# EAGLE design weightmeter (EAGLE 7.2.0)
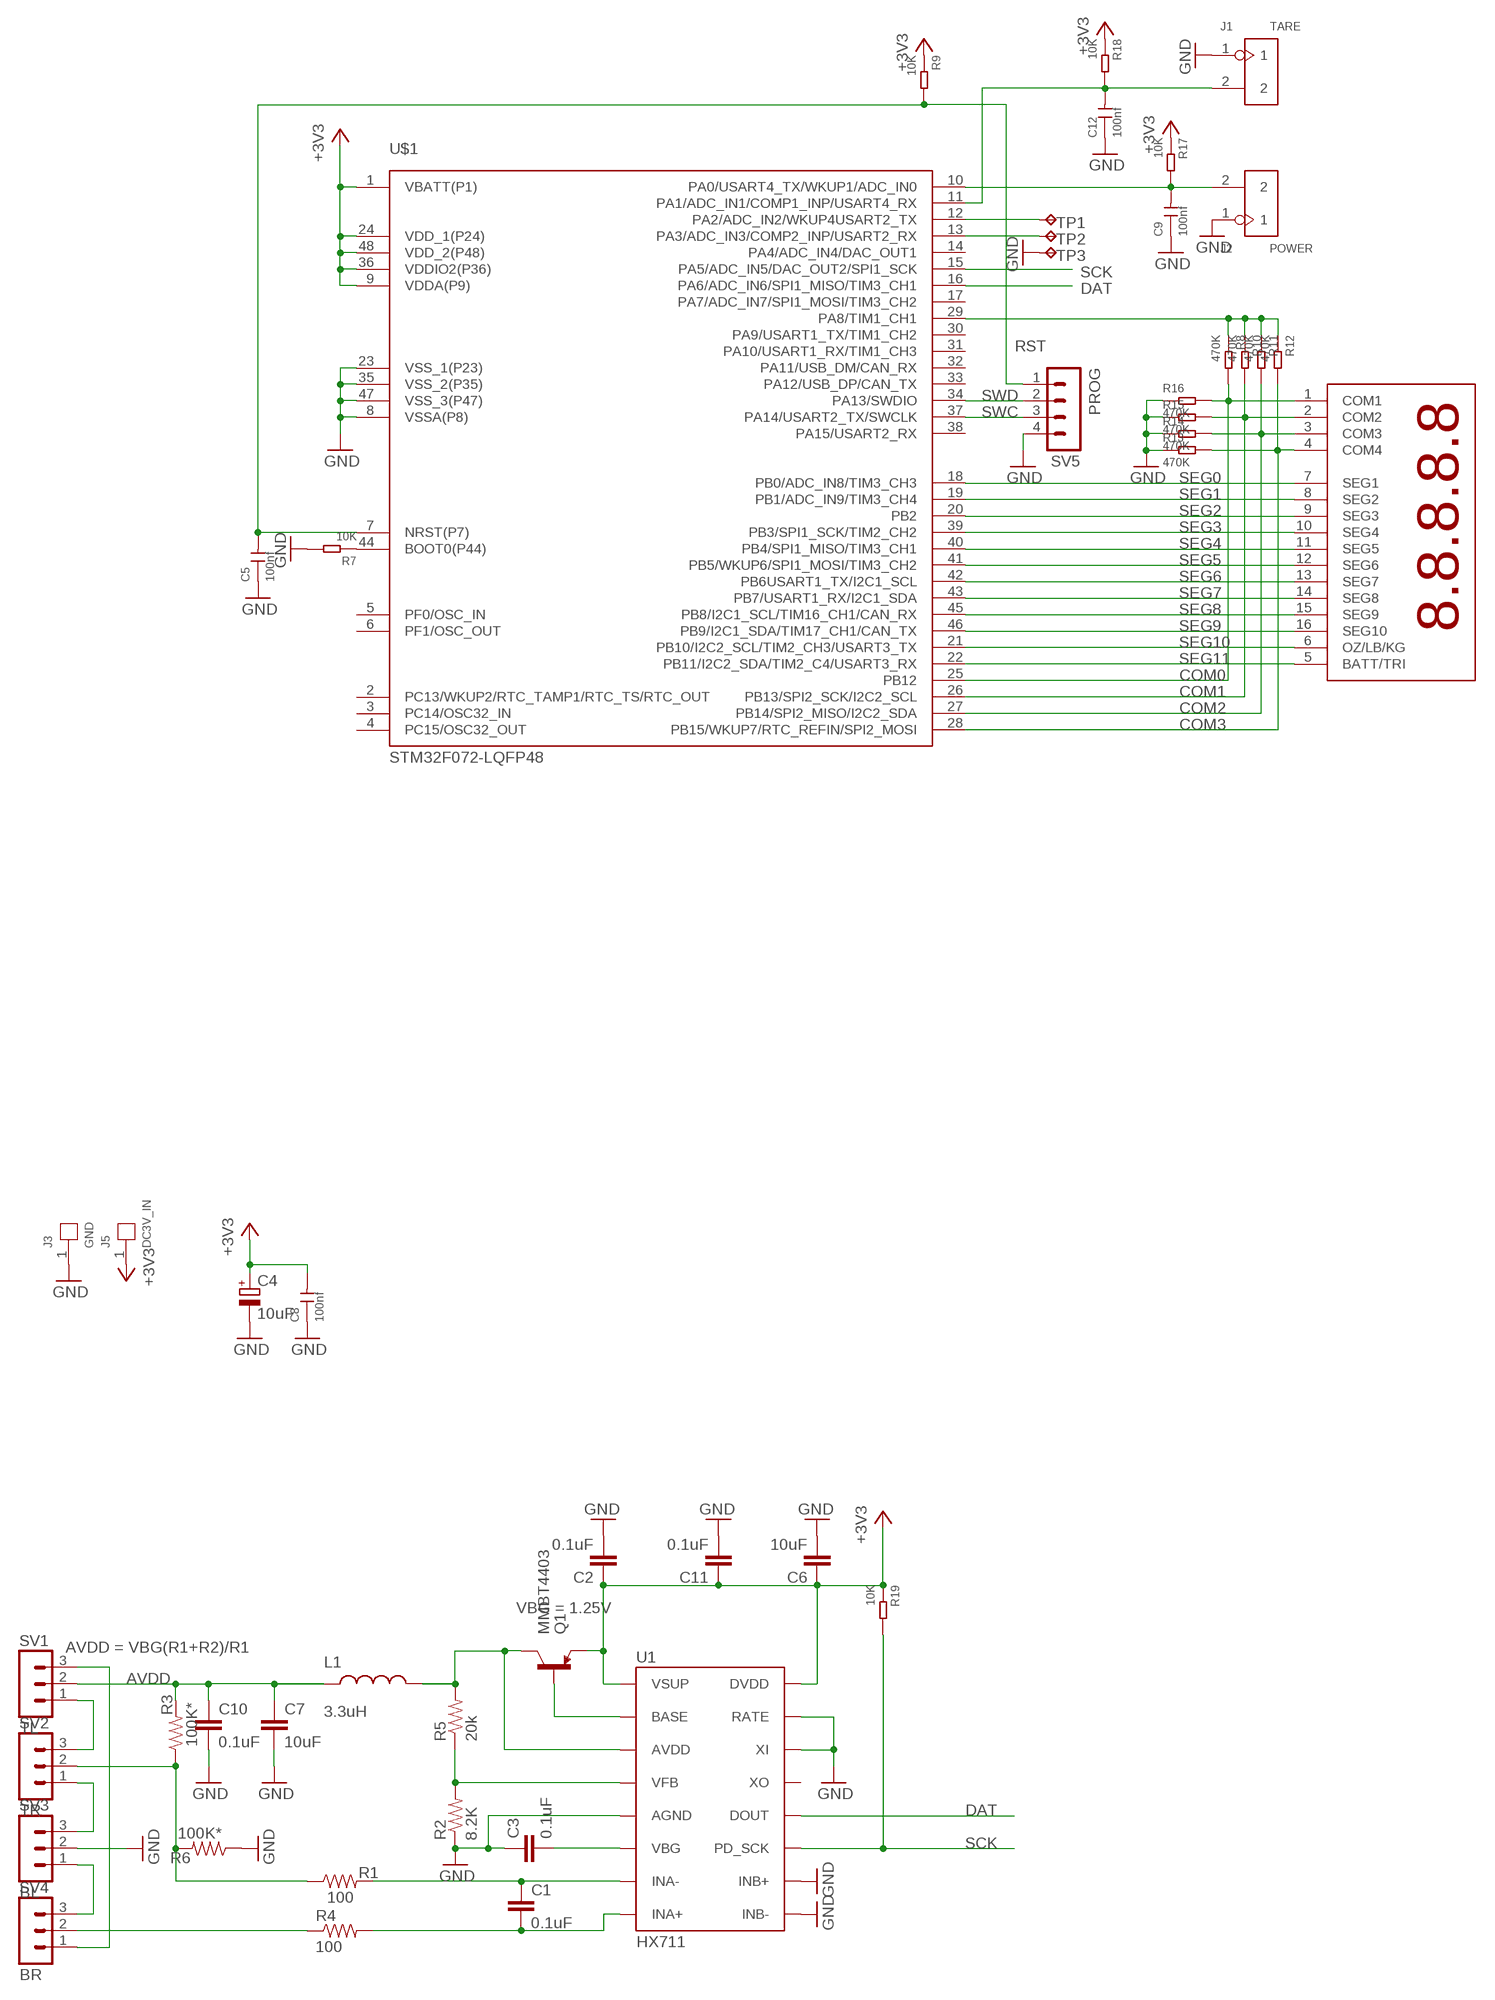
[diagram p0: schematic, sheet 1]

## Parts
C1  0.1uF  0.1UF-25V-5%(0603)  [0603-CAP]
C2  0.1uF  0.1UF-25V-5%(0603)  [0603-CAP]
C3  0.1uF  0.1UF-25V-5%(0603)  [0603-CAP]
C4  10uF  CPOL-EUA/3216-18R  [A/3216-18R]
C5  100nf  CERAMIC-100NF-50V-10%-X7R(0805)  [C0805]
C6  10uF  10UF50V20%(1210)  [1210]
C7  10uF  10UF50V20%(1210)  [1210]
C8  100nf  CERAMIC-100NF-50V-10%-X7R(0805)  [C0805]
C9  100nf  CERAMIC-100NF-50V-10%-X7R(0805)  [C0805]
C10  0.1uF  0.1UF-25V-5%(0603)  [0603-CAP]
C11  0.1uF  0.1UF-25V-5%(0603)  [0603-CAP]
C12  100nf  CERAMIC-100NF-50V-10%-X7R(0805)  [C0805]
J1  TARE  DIP-BLACK-FEMALE-HEADER-VERT(2P-2.54)  [H2-2.54]
J2  POWER  DIP-BLACK-FEMALE-HEADER-VERT(2P-2.54)  [H2-2.54]
J3  GND  DIP-BLACK-ROUND-FEMALE-HEADER-VERT(1P-2.54)  [1P-65/35MIL]
J5  DC3V_IN  DIP-BLACK-ROUND-FEMALE-HEADER-VERT(1P-2.54)  [1P-65/35MIL]
L1  3.3uH  INDUCTOR0805-IND  [0805]
Q1  MMBT4403  TRANSISTOR_PNPMMBT4403  [SOT23-3]
R1  100  100OHM-1/10W-1%(0603)  [0603-RES]
R2  8.2K  8.2KOHM-1/10W-5%(0603)  [0603-RES]
R3  100K*  100OHM-1/10W-1%(0603)  [0603-RES]
R4  100  100OHM-1/10W-1%(0603)  [0603-RES]
R5  20k  20KOHM1/10W1%(0603)  [0603-RES]
R6  100K*  100OHM-1/10W-1%(0603)  [0603-RES]
R7  10K  SMD-RES-0R-5%-1/8W(0805)  [R0805]
R8  470K  SMD-RES-0R-5%-1/8W(0805)  [R0805]
R9  10K  SMD-RES-0R-5%-1/8W(0805)  [R0805]
R10  470K  SMD-RES-0R-5%-1/8W(0805)  [R0805]
R11  470K  SMD-RES-0R-5%-1/8W(0805)  [R0805]
R12  470K  SMD-RES-0R-5%-1/8W(0805)  [R0805]
R13  470K  SMD-RES-0R-5%-1/8W(0805)  [R0805]
R14  470K  SMD-RES-0R-5%-1/8W(0805)  [R0805]
R15  470K  SMD-RES-0R-5%-1/8W(0805)  [R0805]
R16  470K  SMD-RES-0R-5%-1/8W(0805)  [R0805]
R17  10K  SMD-RES-0R-5%-1/8W(0805)  [R0805]
R18  10K  SMD-RES-0R-5%-1/8W(0805)  [R0805]
R19  10K  SMD-RES-0R-5%-1/8W(0805)  [R0805]
SV1  TL  MA03-1  [MA03-1]
SV2  TR  MA03-1  [MA03-1]
SV3  BL  MA03-1  [MA03-1]
SV4  BR  MA03-1  [MA03-1]
SV5  PROG  MA04-1  [MA04-1]
TP1  UART_OUT  TPB1,27  [B1,27]
TP2  UART_OUT  TPB1,27  [B1,27]
TP3  UART_OUT  TPB1,27  [B1,27]
U1  HX711  HX711HX711  [SO16]
U$1  STM32F072-LQFP48  [LQFP48]
X1  1296-T08  [1296-08]

## Nets
+3V3: C2.1 C4.+ C6.1 C8.2 C11.1 J5.1 Q1.2(E) R9.1 R17.1 R18.1 R19.1 U1.1(VSUP) U1.16(DVDD) U$1.1(VBATT(P1)) U$1.9(VDDA(P9)) U$1.24(VDD_1(P24)) U$1.36(VDDIO2(P36)) U$1.48(VDD_2(P48))
A+: R4.1 SV4.2
A-: R1.1 R3.1 R6.2 SV2.2
AVDD: C7.1 C10.1 L1.1 R3.2 SV1.2
COM0: R8.2 R16.2 U$1.25(PB12) X1.1(COM1)
COM1: R10.2 R15.2 U$1.26(PB13/SPI2_SCK/I2C2_SCL) X1.2(COM2)
COM2: R11.2 R14.2 U$1.27(PB14/SPI2_MISO/I2C2_SDA) X1.3(COM3)
COM3: R12.2 R13.2 U$1.28(PB15/WKUP7/RTC_REFIN/SPI2_MOSI) X1.4(COM4)
DAT: U1.12(DOUT) U$1.16(PA6/ADC_IN6/SPI1_MISO/TIM3_CH1)
GND: C2.2 C3.1 C4.- C5.1 C6.2 C7.2 C8.1 C9.1 C10.2 C11.2 C12.1 J1.1 J2.1 J3.1 R2.1 R6.1 R7.2 R13.1 R14.1 R15.1 R16.1 SV3.2 SV5.4 TP3.TP U1.5(AGND) U1.9(INB-) U1.10(INB+) U1.14(XI) U1.15(RATE) U$1.8(VSSA(P8)) U$1.23(VSS_1(P23)) U$1.35(VSS_2(P35)) U$1.47(VSS_3(P47))
N$2: SV1.1 SV2.3
N$3: SV2.1 SV3.3
N$4: SV3.1 SV4.3
N$5: SV1.3 SV4.1
N$7: Q1.1(B) U1.2(BASE)
N$8: R2.2 R5.1 U1.4(VFB)
N$9: C3.2 U1.6(VBG)
N$10: L1.2 Q1.3(C) R5.2 U1.3(AVDD)
N$11: TP1.TP U$1.12(PA2/ADC_IN2/WKUP4USART2_TX)
N$12: C1.1 R1.2 U1.7(INA-)
N$13: C1.2 R4.2 U1.8(INA+)
N$14: TP2.TP U$1.13(PA3/ADC_IN3/COMP2_INP/USART2_RX)
N$15: C12.2 J1.2 R18.2 U$1.11(PA1/ADC_IN1/COMP1_INP/USART4_RX)
N$16: R7.1 U$1.44(BOOT0(P44))
N$19: C9.2 J2.2 R17.2 U$1.10(PA0/USART4_TX/WKUP1/ADC_IN0)
N$36: R8.1 R10.1 R11.1 R12.1 U$1.29(PA8/TIM1_CH1)
RST: C5.2 R9.2 SV5.1 U$1.7(NRST(P7))
SCK: R19.2 U1.11(PD_SCK) U$1.15(PA5/ADC_IN5/DAC_OUT2/SPI1_SCK)
SEG0: U$1.18(PB0/ADC_IN8/TIM3_CH3) X1.7(SEG1)
SEG1: U$1.19(PB1/ADC_IN9/TIM3_CH4) X1.8(SEG2)
SEG2: U$1.20(PB2) X1.9(SEG3)
SEG3: U$1.39(PB3/SPI1_SCK/TIM2_CH2) X1.10(SEG4)
SEG4: U$1.40(PB4/SPI1_MISO/TIM3_CH1) X1.11(SEG5)
SEG5: U$1.41(PB5/WKUP6/SPI1_MOSI/TIM3_CH2) X1.12(SEG6)
SEG6: U$1.42(PB6USART1_TX/I2C1_SCL) X1.13(SEG7)
SEG7: U$1.43(PB7/USART1_RX/I2C1_SDA) X1.14(SEG8)
SEG8: U$1.45(PB8/I2C1_SCL/TIM16_CH1/CAN_RX) X1.15(SEG9)
SEG9: U$1.46(PB9/I2C1_SDA/TIM17_CH1/CAN_TX) X1.16(SEG10)
SEG10: U$1.21(PB10/I2C2_SCL/TIM2_CH3/USART3_TX) X1.6(OZ/LB/KG)
SEG11: U$1.22(PB11/I2C2_SDA/TIM2_C4/USART3_RX) X1.5(BATT/TRI)
SWC: SV5.3 U$1.37(PA14/USART2_TX/SWCLK)
SWD: SV5.2 U$1.34(PA13/SWDIO)
Unconnected: U1.13(XO) U$1.2(PC13/WKUP2/RTC_TAMP1/RTC_TS/RTC_OUT) U$1.3(PC14/OSC32_IN) U$1.4(PC15/OSC32_OUT) U$1.5(PF0/OSC_IN) U$1.6(PF1/OSC_OUT) U$1.14(PA4/ADC_IN4/DAC_OUT1) U$1.17(PA7/ADC_IN7/SPI1_MOSI/TIM3_CH2) U$1.30(PA9/USART1_TX/TIM1_CH2) U$1.31(PA10/USART1_RX/TIM1_CH3) U$1.32(PA11/USB_DM/CAN_RX) U$1.33(PA12/USB_DP/CAN_TX) U$1.38(PA15/USART2_RX)

## Notes on the sheet
- VBG = 1.25V
- AVDD = VBG(R1+R2)/R1

## Library data of the parts
C1-C3 C10 C11 = SparkFun-Capacitors:0.1UF-25V-5%(0603): CAP-08604; PROD_ID: CAP-08604
C4 = rcl:CPOL-EU: POLARIZED CAPACITOR, European symbol
C5 C8 C9 C12 = Seeed-OPL-Capacitor:CERAMIC-100NF-50V-10%-X7R(0805): 302010165; MPN: CC0805KRX7R9BB104
C6 C7 = SparkFun-Capacitors:10UF50V20%(1210): CAP-09824; PROD_ID: CAP-09824
J1 J2 = Seeed-OPL-Connector:DIP-BLACK-FEMALE-HEADER-VERT(2P-2.54): 320030023; MPN: F185-1102A1BSYA1; VALUE: 2p-2.54
J3 J5 = Seeed-OPL-Connector:DIP-BLACK-ROUND-FEMALE-HEADER-VERT(1P-2.54): 320030026; MPN: RF130-1013BBS0741; VALUE: 1p-2.54
L1 = SparkFun-Passives:INDUCTOR: Inductors Basic Inductor/Choke - 0603 and 1206. Footprints are not proven and vary greatly between part numbers. INDUCTOR POWER 3.3UH 4.0A SMD 0.197" L x 0.197" W x 0.177" H (5.00mm x 5.00mm x 4.50mm); PROD_ID: NDUC-13076
Q1 = SparkFun-DiscreteSemi:TRANSISTOR_PNP: Generic PNP BJT Double check pinouts against datasheets- not all devices are the same! MMBT3906 - 40V 200mA SOT-23 (TRANS-08052) MMBT4403 - 40V 600mA SOT-23 (TRANS-09245); PROD_ID: TRANS-09245
R1 R4 = SparkFun-Resistors:100OHM-1/10W-1%(0603): RES-07863; PROD_ID: RES-07863
R2 = SparkFun-Resistors:8.2KOHM-1/10W-5%(0603): RES-10646; PROD_ID: RES-10646
R3 R6 = SparkFun-Resistors:100OHM-1/10W-1%(0603): RES-07863; PROD_ID: RES-07863; VALUE: 100
R5 = SparkFun-Resistors:20KOHM1/10W1%(0603): RES-09383; PROD_ID: RES-09383
R7-R19 = Seeed-OPL-Resistor:SMD-RES-0R-5%-1/8W(0805): 301010359; MPN: RC0805JR-070RL; VALUE: 0R 1/8W
SV1-SV4 = con-lstb:MA03-1: PIN HEADER; OC_FARNELL: unknown; OC_NEWARK: unknown
SV5 = con-lstb:MA04-1: PIN HEADER; OC_FARNELL: unknown; OC_NEWARK: unknown
TP1-TP3 = testpad:TP: Test pad
U1 = Testing:HX711; PROD_ID: IC-12445
U$1 = stm32f0:STM32F072
X1 = conn:1296-T08: 1.27mm SINGLE ROW FEMALE SOCKET Source: http://www.leotronics.co.uk/Conexcon/Data%20Sheets/sec.%20A/1296ing.pdf

## Board
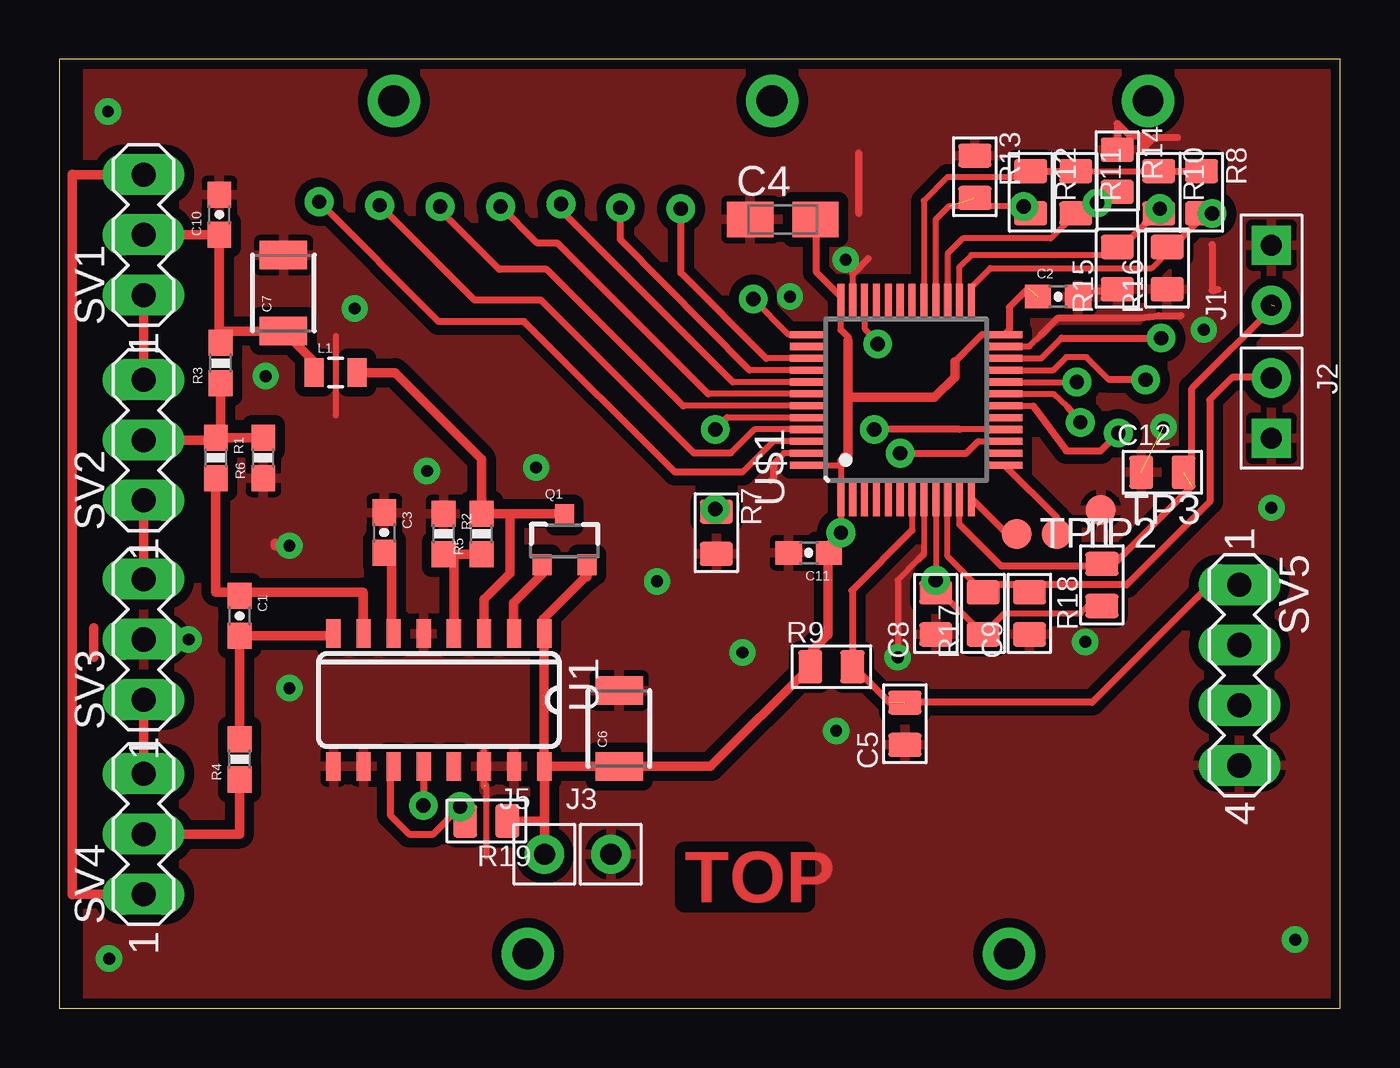
[diagram p1: board, top side]
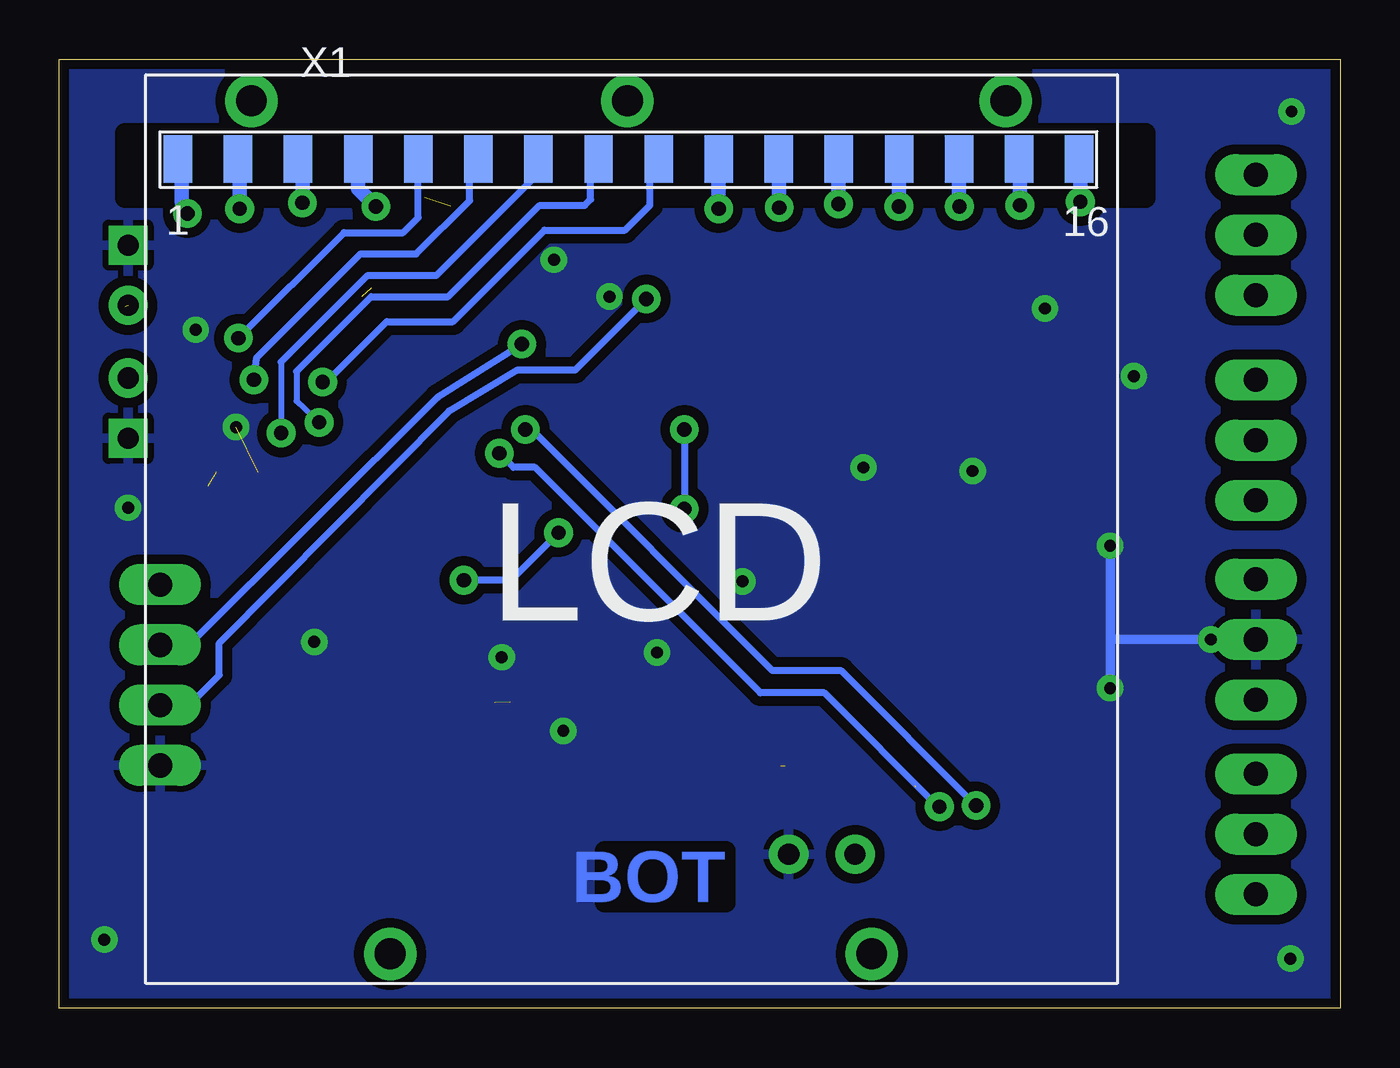
[diagram p2: board, bottom side, seen from below]

Size 54 x 40 mm. Coordinates in mm from the lower left corner, seen from the top.
Outline: 0,0 54,0 54,40 0,40 0,0
Copper layers (1*16): Top 0.035mm / dielectric 1.5mm / Bottom 0.035mm
Design rules "SeeedStudio_2layer_DRU_no_angle_20140221 *": minimum track width 6mil, minimum drill 12mil, track to track 6mil, track to pad 6mil, pad to pad 6mil, via to via 6mil, smd to smd 0mil, copper to edge 10mil, drill to drill 10mil, minimum pad ring 10mil, minimum via ring 12mil, stop-mask expansion 2mil, vias tented up to drill 100mil, thermal gap 10mil
bRestrict: area 8.2,34.1 to 51.2,36.9

### Footprints (pad centres in the part's own frame; a part is rotated, then mirrored left to right if it is on the bottom)
0603-CAP = smd 1.1 x 1: 1 -0.85,0; 2 0.85,0
A/3216-18R = smd 1.95 x 1.5: + 1.375,0; - -1.375,0
C0805 = smd 1.397 x 1.016: 1 0,0.889; 2 0,-0.889
1210 = smd 1.2 x 2: 1 -1.6,0; 2 1.6,0
H2-2.54 = drill 0.889 pad 1.651 square: 1 0,1.27 | drill 0.889 pad 1.651: 2 0,-1.27
1P-65/35MIL = drill 0.889 pad 1.651: 1 0,0
0805 = smd 0.8 x 1.2: 1 -0.9,0; 2 0.9,0
SOT23-3 = smd 0.8 x 0.9: 1 -0.95,-1; 2 0.95,-1; 3 0,1.1
0603-RES = smd 1.1 x 1: 1 -0.85,0; 2 0.85,0
R0805 = smd 1.397 x 1.016: 1 0,0.889; 2 0,-0.889
MA03-1 = drill 1.016 long: 1 -2.54,0; 2 0,0; 3 2.54,0
MA04-1 = drill 1.016 long: 1 -3.81,0; 2 -1.27,0; 3 1.27,0; 4 3.81,0
B1,27 = smd 1.27 x 1.27: TP 0,0
SO16 = smd 0.6 x 1.2: 1 -4.445,-2.8; 2 -3.175,-2.8; 3 -1.905,-2.8; 4 -0.635,-2.8; 5 0.635,-2.8; 6 1.905,-2.8; 7 3.175,-2.8; 8 4.445,-2.8; 9 4.445,2.8; 10 3.175,2.8; 11 1.905,2.8; 12 0.635,2.8; 13 -0.635,2.8; 14 -1.905,2.8; 15 -3.175,2.8; 16 -4.445,2.8
LQFP48 = smd 1.5 x 0.3: 1 -4.15,2.75; 2 -4.15,2.25; 3 -4.15,1.75; 4 -4.15,1.25; 5 -4.15,0.75; 6 -4.15,0.25; 7 -4.15,-0.25; 8 -4.15,-0.75; 9 -4.15,-1.25; 10 -4.15,-1.75; 11 -4.15,-2.25; 12 -4.15,-2.75; 25 4.15,-2.75; 26 4.15,-2.25; 27 4.15,-1.75; 28 4.15,-1.25; 29 4.15,-0.75; 30 4.15,-0.25; 31 4.15,0.25; 32 4.15,0.75; 33 4.15,1.25; 34 4.15,1.75; 35 4.15,2.25; 36 4.15,2.75 | smd 0.3 x 1.5: 13 -2.75,-4.15; 14 -2.25,-4.15; 15 -1.75,-4.15; 16 -1.25,-4.15; 17 -0.75,-4.15; 18 -0.25,-4.15; 19 0.25,-4.15; 20 0.75,-4.15; 21 1.25,-4.15; 22 1.75,-4.15; 23 2.25,-4.15; 24 2.75,-4.15; 37 2.75,4.15; 38 2.25,4.15; 39 1.75,4.15; 40 1.25,4.15; 41 0.75,4.15; 42 0.25,4.15; 43 -0.25,4.15; 44 -0.75,4.15; 45 -1.25,4.15; 46 -1.75,4.15; 47 -2.25,4.15; 48 -2.75,4.15
1296-08 = smd 1.2 x 2: 1 0,1; 2 2.533,1; 3 5.067,1; 4 7.6,1; 5 10.133,1; 6 12.667,1; 7 15.2,1; 8 17.733,1; 9 20.267,1; 10 22.8,1; 11 25.333,1; 12 27.867,1; 13 30.4,1; 14 32.933,1; 15 35.467,1; 16 38,1 | drill 1.3: P$1 8.95,-32.5; P$2 29.25,-32.5; P$3 34.9,3.45; P$4 18.95,3.45; P$5 3.1,3.45

### Placement (x,y rotation side)
C1  7.6,16.55 270 top
C2  42.1,30 0 top
C3  13.7,20.05 270 top
C4  30.5,33.25 0 top
C5  35.65,12 180 top
C6  23.6,11.8 90 top
C7  9.45,30.15 90 top
C8  36.95,16.65 180 top
C9  40.9,16.65 180 top
C10  6.75,33.45 90 top
C11  31.6,19.2 180 top
C12  46.5,22.6 90 top
J1  51.1,30.9 0 top
J2  51.1,25.3 180 top
J3  23.25,6.5 0 top
J5  20.45,6.5 0 top
L1  11.65,26.8 0 top
Q1  21.3,19.7 0 top
R1  6.6,23.2 270 top
R2  16.2,20 270 top
R3  6.8,27.2 90 top
R4  7.6,10.5 90 top
R5  17.8,20 90 top
R6  8.6,23.2 90 top
R7  27.7,20.05 0 top
R8  48.15,34.4 0 top
R9  32.55,14.4 90 top
R10  46.35,34.4 0 top
R11  42.85,34.4 0 top
R12  40.95,34.4 0 top
R13  38.6,35.05 0 top
R14  44.6,35.3 0 top
R15  44.6,31.2 180 top
R16  46.7,31.2 180 top
R17  38.95,16.65 180 top
R18  43.95,17.85 180 top
R19  18,7.9 270 top
SV1  3.55,32.6 90 top
SV2  3.55,23.95 90 top
SV3  3.55,15.55 90 top
SV4  3.55,7.35 90 top
SV5  49.75,14.05 270 top
TP1  40.35,20 0 top
TP2  42.05,20 0 top
TP3  43.9,21 0 top
U1  16,13 180 top
U$1  35.7,25.65 90 top
X1  49,34.8 0 bottom

### Tracks (layer width: path | path; a pad name or v marks a point on that pad's centre or on a via)
+3V3  (via drill 0.6)  (2 unrouted)
  Top 0.254: U$1.9 v36.95,18.05 | 32.95,28.6 U$1.36 | U$1.48 32.95,22.9 U$1.1 v32.95,20.05 | 37.17,17.54 R17.1 39.84,16.65 43.05,16.65 43.36,16.96 R18.1
  Top 0.305: v36.95,18.05 C8.2 37.17,17.54 | R9.1 | 33.1,23.25 32.95,23.1 32.95,22.9 | 33.25,28.15 33.25,28.3 32.95,28.6 | 40.86,30.36 40.05,29.55 40.05,28.6 U$1.24 38.9,28.4 37.75,27.25 | C4.+ 31.9,32.73 31.9,31.05 32.95,30 U$1.36
  Top 0.406: 22.25,18.2 Q1.2 22.25,18.25 20.4,16.4 20.4,15.85 U1.1 U1.16 | U1.16 20.45,7.9 | 20.45,7.9 J5.1 | U1.16 23.4,10.2 | C6.1 27.46,10.2 R9.1 31.75,14.49 31.75,15.1 32.4,15.75 32.4,19.15 C11.1 32.45,19.55 v32.95,20.05 | 37.75,27.25 37.75,26.6 36.9,25.75 33.25,25.75 | 33.1,23.25 33.25,23.25 33.25,25.75 | 33.25,25.75 33.25,28.15 | R19.1 20.45,7.9
  Bottom 0.305: v32.95,20.05 34.95,18.05 v36.95,18.05
A+
  Top 0.406: SV4.2 7.6,7.35 R4.1
A-
  Top 0.305: 6.55,24 R1.1
  Top 0.406: SV2.2 6.6,23.95 R1.1 | R1.1 R6.2 | R3.1 6.8,24.25 arc-90 R1.1
AVDD
  Top 0.305: 6.55,28.1 R3.2
  Top 0.406: 6.75,28.55 C10.1 SV1.2 | 6.75,28.55 6.75,28.1 R3.2 | 6.75,28.55 C7.1 10.75,27.25 L1.1
COM0  (via drill 0.6)
  Top 0.254: U$1.25 38.45,30.4 39.25,31.2 46.05,31.2 46.83,31.98
  Top 0.305: R16.2 46.81,31.98 46.83,31.98 48.15,33.3 R8.2 48.34,33.51 v48.6,33.5
  Bottom 0.305: 48.85,35.65 X1.1
  Bottom 0.61: 48.85,35.65 48.85,34 v48.6,33.5
COM1  (via drill 0.6)
  Top 0.254: U$1.26 37.95,31.25 38.45,31.75 44.46,31.75
  Top 0.305: 44.6,31.89 45.76,33.05 v46.4,33.7 46.35,33.65 R10.2 | 44.6,31.89 44.46,31.75 | R15.2 44.6,31.89
  Bottom 0.305: 46.2,35.53 X1.2 46.4,35.38
  Bottom 0.61: 46.4,35.38 v46.4,33.7
COM2  (via drill 0.6)
  Top 0.254: R11.2 41.8,32.45 38.1,32.45 37.45,31.8 U$1.27
  Top 0.305: v43.75,33.95 43.45,33.9 | v43.75,33.95 43.54,33.95 R11.2 | v43.75,33.95 44.14,33.95 R14.2
  Bottom 0.305: X1.3 43.95,35.78 arc90 43.75,35.63
  Bottom 0.61: 43.75,35.63 v43.75,33.95
COM3  (via drill 0.6)  (1 unrouted)
  Top 0.254: U$1.28 36.95,33.25 37.5,33.8 v40.65,33.8
  Top 0.305: R12.2 40.51,33.95 v40.65,33.8
  Bottom 0.61: v40.65,33.8 41.4,34.55 X1.4
DAT  (via drill 0.6)
  Top 0.254: U$1.16 37.95,24.4
  Top 0.305: U1.12 15.37,8.56 v15.35,8.55 | 37.95,24.4 v34.35,24.4
  Bottom 0.305: v15.35,8.55 21.05,14.25 23.95,14.25 34.1,24.4 v34.35,24.4
GND  (via drill 0.5)  (2 unrouted)
  Top 0.254: U$1.47 30.55,23.4 30.1,22.95 | U$1.8 36.45,19.15 | 11.65,28.35 11.65,25 | U$1.35 33.45,30.95 | U$1.23 40.9,27.9 41.4,28.4 | 36.25,18.95 35.35,18.05 v35.35,14.8 | 17.9,9.35 17.9,10.85 | 17.95,9.4 18,9.4 18,6.4
  Top 0.305: 30.1,22.95 30.1,22.35 30,22.25 | 36.45,19.15 36.25,18.95 | 33.45,30.95 34.1,31.6 | 47.15,36.7 46.15,36.7 45.6,36.15 45.6,36.45 45.9,36.75 45.15,36.75 44.6,37.3 44.6,36.65 45.1,36.15 | 48.6,32.2 48.6,30.25 48.85,30.3 | 41.4,28.4 42.1,29.1 45.55,29.1 46.35,29.2 47.3,29.2 | 33.7,36.05 33.7,33.5 | 42.9,30.1 43.05,30.25 44.65,30.25
  Top 0.406: SV3.2 v5.45,15.55 | v9.7,19.5 9.1,19.5 9.1,19.6
  Bottom 0.406: v5.45,15.55 9.7,15.55 v9.7,19.5 | 9.65,15.6 9.7,15.6 v9.7,13.5
  other vias: 43.25,15.45 46.55,24.5 48.25,28.6 51.1,21.1 30.8,30 20.1,22.8 15.5,22.65 8.7,26.65 12.45,29.5 2.05,37.8 2.1,2.1 52.1,2.9 33.15,31.55 28.8,15 25.2,18 32.75,11.7
  pour Top (isolate 0.406): 1.2,39.8 53.8,39.8 53.8,0.2 1.2,0.2
  pour Bottom (isolate 0.406): 0.15,39.85 53.8,39.85 53.8,0.15 0.15,0.15
N$2
  Top 0.406: SV1.1 SV2.3
N$3
  Top 0.406: SV2.1 SV3.3
N$4
  Top 0.406: SV3.1 SV4.3
N$5
  Top 0.406: SV4.1 0.56,4.81 0.55,4.8 0.55,35.15 0.64,35.14 SV1.3
N$7
  Top 0.406: Q1.1 20.35,18.3 19.15,17.1 19.15,15.82 U1.2
N$8
  Top 0.406: R2.2 16.64,19.15 | R5.1 16.7,19.15 16.64,19.15 | U1.4 16.64,19.15
N$9
  Top 0.406: U1.6 14.1,16.15 14,16.15 14,19.2 C3.2
N$10
  Top 0.406: U1.3 17.91,17.25 19,18.35 19,20.85 | 19,20.85 R5.2 17.8,23.15 14.15,26.8 L1.2 | Q1.3 21.3,20.85 19,20.85
N$11
  Top 0.305: U$1.12 39.95,20 TP1.TP
N$12
  Top 0.406: R1.2 6.6,17.55 7.55,17.55 7.6,17.55 | 7.6,17.55 12.8,17.55 12.8,15.8 U1.7 | C1.1 7.6,17.55
N$13
  Top 0.406: R4.2 C1.2 11.55,15.7 U1.8
N$14
  Top 0.305: U$1.13 42.05,20.7 TP2.TP
N$15  (2 unrouted)
  Top 0.254: 37.95,20.4 U$1.11
  Top 0.305: 37.95,20.4 39.7,18.65 43.95,18.65 44.4,18.65 47.75,22 47.75,26.13 51.22,29.6
  Top 0.406: R18.2 43.95,18.65 | C12.2 47.2,22.6 47.2,22.65
N$16  (via drill 0.6)
  Top 0.254: U$1.44 28.15,24.9
  Top 0.305: 28.15,24.9 v27.65,24.4 | v27.65,21.05 27.54,21 R7.1
  Bottom 0.305: v27.65,24.4 v27.65,21.05
N$19
  Top 0.254: 38.65,17.85 37.45,19.05 U$1.10
  Top 0.305: J2.2 51.17,26.6 49.45,26.6 48.5,25.65 48.5,21.35 45,17.85 40.8,17.85 | 40.8,17.85 38.95,17.85 | 38.95,17.85 38.65,17.85 | R17.2 38.95,17.85 | C9.2 40.9,17.75 40.8,17.85
N$35
  Top 0.406: 1.45,16.05 1.45,14.8
N$36
  Top 0.254: U$1.29 36.45,34.05 37.45,35.05 40.71,35.05 | R11.1 R10.1
  Top 0.305: 40.71,35.05 R12.1 R11.1 | R10.1 R8.1
RST  (1 unrouted)
  Top 0.254: U$1.7 35.95,20.15
  Top 0.305: 35.95,20.15 33.41,17.61 33.44,17.58 R9.2 33.41,14.49 35,12.9 43.55,12.9 48,17.35 48.49,17.85 SV5.1
SCK  (via drill 0.6)
  Top 0.254: 38.75,23.9 U$1.15
  Top 0.305: U1.11 13.95,10.05 13.95,8.15 14.75,7.35 15.75,7.35 v16.9,8.5 | v35.45,23.4 38.25,23.4 38.75,23.9
  Top 0.406: R19.2 16.9,7.9 v16.9,8.5
  Bottom 0.305: v16.9,8.5 16.95,8.5 21.75,13.3 24.45,13.3 33.95,22.8 34.85,22.8 v35.45,23.4
SEG0  (via drill 0.6)
  Top 0.254: U$1.18 41.05,25.4
  Top 0.305: 41.05,25.4 42.45,23.5 43.9,23.5 v44.65,24.25
  Bottom 0.254: 44.65,27.25 v44.65,24.25
  Bottom 0.305: 44.65,27.25 41,30.9 38.1,30.9 33.8,35.2 X1.7
SEG1  (via drill 0.6)
  Top 0.254: U$1.19 41.9,25.9 42.5,25.35
  Top 0.305: 42.5,25.35 v43.05,24.7
  Bottom 0.254: 44,26.85 44,25.6 v43.05,24.7
  Bottom 0.305: 44,26.85 40.85,30 37.6,30 33.75,33.85 31.85,33.85 31.6,34.1 31.6,35.4 31.27,35.73 X1.8
SEG2  (via drill 0.6)
  Top 0.254: U$1.20 v42.9,26.4
  Bottom 0.305: v42.9,26.4 42.75,26.4 40.2,28.95 37.4,28.95 33.55,32.8 30.15,32.8 29.1,33.85 29.1,35.25 28.73,35.62 X1.9
SEG3  (via drill 0.6)
  Top 0.254: U$1.39 29.8,27.4
  Top 0.305: 29.8,27.4 26.2,31 v26.2,33.7
  Bottom 0.61: v26.2,33.7 X1.10
SEG4  (via drill 0.6)
  Top 0.254: U$1.40 29.1,26.9
  Top 0.305: 29.1,26.9 23.65,32.4 v23.65,33.75
  Bottom 0.305: 23.65,35.78 X1.11
  Bottom 0.61: v23.65,33.75 23.65,35.78
SEG5  (via drill 0.6)
  Top 0.254: U$1.41 28.4,26.4
  Top 0.305: 28.4,26.4 21.15,33.65 v21.15,33.9
  Bottom 0.305: 21.15,35.78 X1.12
  Bottom 0.61: v21.15,33.9 21.15,35.78
SEG6  (via drill 0.6)
  Top 0.254: U$1.42 27.35,25.9
  Top 0.305: 27.35,25.9 21,32.25 20.15,32.25 v18.6,33.8
  Bottom 0.61: v18.6,33.8 X1.13
SEG7  (via drill 0.6)
  Top 0.254: U$1.43 26.3,25.4
  Top 0.305: 26.3,25.4 20.55,31.15 18.55,31.15 16.05,33.65 v16.05,33.8
  Bottom 0.305: v16.05,33.8 16.07,33.82
  Bottom 0.61: 16.07,33.82 X1.14
SEG8  (via drill 0.6)
  Top 0.254: U$1.45 29.3,24.4 28.3,23.4
  Top 0.305: v13.5,33.85 17.5,29.85 20.3,29.85 26.75,23.4 28.3,23.4
  Bottom 0.305: 13.5,35.77 X1.15
  Bottom 0.61: v13.5,33.85 13.5,35.77
SEG9  (via drill 0.6)
  Top 0.254: U$1.46 30.1,23.9 28.8,22.6
  Top 0.305: v10.95,34 16,28.95 19.6,28.95 25.95,22.6 28.8,22.6
  Bottom 0.305: 10.95,35.75 X1.16
  Bottom 0.61: v10.95,34 10.95,35.75
SEG10  (via drill 0.6)
  Top 0.254: U$1.21 41.9,26.9 42.45,27.45 43.3,27.45 44.25,26.5
  Top 0.305: v45.8,26.5 44.25,26.5
  Bottom 0.305: X1.6 36.33,35.72 36.7,35.35 36.7,34.05 38.95,31.8 41.3,31.8 45.7,27.4 v45.8,26.5
SEG11  (via drill 0.6)
  Top 0.254: U$1.22 41.4,27.4 42.25,28.25
  Top 0.305: 42.25,28.25 v46.45,28.25
  Bottom 0.305: v46.45,28.25 42,32.7 39.5,32.7 38.87,33.33 X1.5
SWC  (via drill 0.6)
  Top 0.254: v29.25,29.9 30.75,28.4 U$1.37
  Bottom 0.305: 49.78,12.8 SV5.3 49.73,12.8 48.5,12.8 47.25,14.05 47.25,15.4 37.58,25.18 34.7,26.9 32.25,26.9 v29.25,29.9
SWD  (via drill 0.6)
  Top 0.254: U$1.34 33.95,28.65 34.6,28
  Top 0.305: 34.6,28 v34.5,28
  Bottom 0.305: 49.77,15.35 SV5.2 48.58,15.27 38.05,25.75 v34.5,28

### Text on the board
Top: TOP
Bottom: BOT